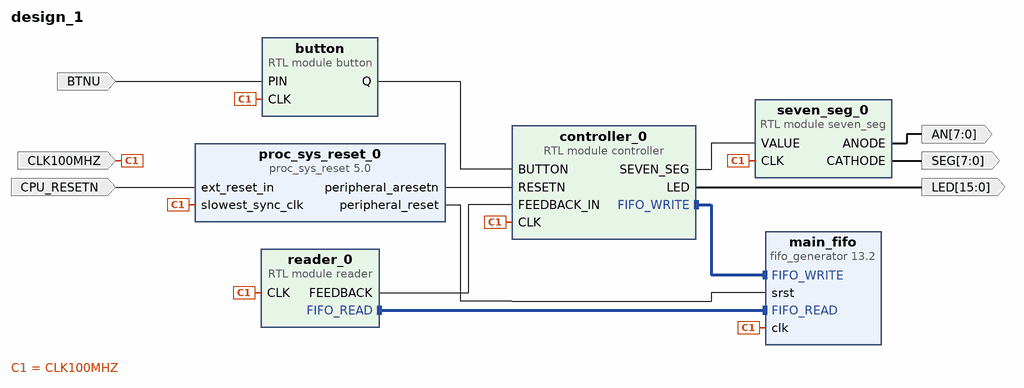
[diagram p0: block diagram of the top level]
# Vivado block design design_1, xc7a100tcsg324-1, Vivado 2021.2
create_bd_design design_1

create_bd_port -dir I -type clk CLK100MHZ
create_bd_port -dir I BTNU
create_bd_port -dir O -from 15 -to 0 LED
create_bd_port -dir I -type rst CPU_RESETN
create_bd_port -dir O -from 7 -to 0 SEG
create_bd_port -dir O -from 7 -to 0 AN

create_bd_cell -type module -reference button button
create_bd_cell -type module -reference seven_seg seven_seg_0
set_property -dict {CONFIG.C_STYLE 0} [get_bd_cells seven_seg_0]
create_bd_cell -type ip -vlnv xilinx.com:ip:fifo_generator:13.2 main_fifo
set_property -dict [list \
  CONFIG.Fifo_Implementation Common_Clock_Distributed_RAM \
  CONFIG.Input_Data_Width 16 \
  CONFIG.Performance_Options First_Word_Fall_Through \
] [get_bd_cells main_fifo]
create_bd_cell -type ip -vlnv xilinx.com:ip:proc_sys_reset:5.0 proc_sys_reset_0
set_property -dict [list \
  CONFIG.C_NUM_BUS_RST 4 \
  CONFIG.C_NUM_INTERCONNECT_ARESETN 4 \
  CONFIG.C_NUM_PERP_ARESETN 4 \
  CONFIG.C_NUM_PERP_RST 4 \
] [get_bd_cells proc_sys_reset_0]
create_bd_cell -type module -reference reader reader_0
create_bd_cell -type module -reference controller controller_0

# ---- connections ----

connect_bd_intf_net [get_bd_intf_pins main_fifo/FIFO_WRITE] [get_bd_intf_pins controller_0/FIFO_WRITE]
connect_bd_intf_net [get_bd_intf_pins reader_0/FIFO_READ] [get_bd_intf_pins main_fifo/FIFO_READ]
connect_bd_net [get_bd_ports CLK100MHZ] \
  [get_bd_pins seven_seg_0/CLK] [get_bd_pins reader_0/CLK] [get_bd_pins proc_sys_reset_0/slowest_sync_clk] \
  [get_bd_pins controller_0/CLK] [get_bd_pins main_fifo/clk] [get_bd_pins button/CLK]
connect_bd_net -net PIN_0_1 [get_bd_ports BTNU] [get_bd_pins button/PIN]
connect_bd_net -net RESETN_0_1 [get_bd_ports CPU_RESETN] [get_bd_pins proc_sys_reset_0/ext_reset_in]
connect_bd_net -net button_0_Q [get_bd_pins button/Q] [get_bd_pins controller_0/BUTTON]
connect_bd_net [get_bd_pins controller_0/LED] [get_bd_ports LED]
connect_bd_net [get_bd_pins controller_0/SEVEN_SEG] [get_bd_pins seven_seg_0/VALUE]
connect_bd_net [get_bd_pins proc_sys_reset_0/peripheral_aresetn] [get_bd_pins controller_0/RESETN]
connect_bd_net [get_bd_pins proc_sys_reset_0/peripheral_reset] [get_bd_pins main_fifo/srst]
connect_bd_net [get_bd_pins reader_0/FEEDBACK] [get_bd_pins controller_0/FEEDBACK_IN]
connect_bd_net [get_bd_pins seven_seg_0/ANODE] [get_bd_ports AN]
connect_bd_net [get_bd_pins seven_seg_0/CATHODE] [get_bd_ports SEG]

validate_bd_design
save_bd_design
